# EAGLE schematic bk-circ2-S (EAGLE 9.1.0)
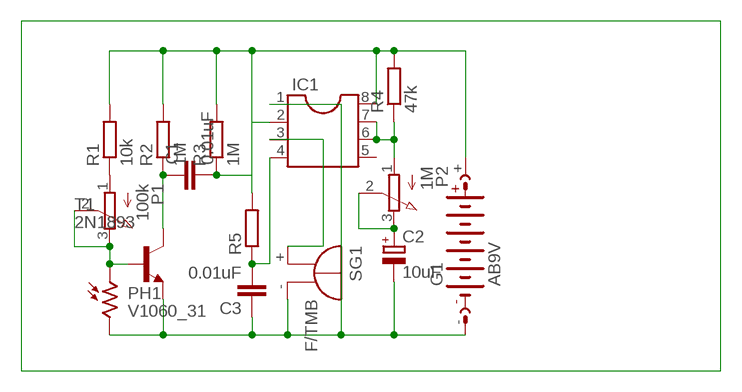
[diagram p0: schematic, sheet 1]

## Parts
C1  0.01uF  C-EU050-025X075  [C050-025X075]
C2  10uF  CPOL-EUB45181B  [B45181B]
C3  0.01uF  C-EU050-025X075  [C050-025X075]
G1  AB9V  [AB9V]
IC1  DIL8  [DIL08]
P1  100k  3RP/1610N  [3RP/1610N]
P2  1M  3RP/1610N  [3RP/1610N]
PH1  V1060_31  [TO-5_V10]
R1  10k  R-EU_0207/7  [0207/7]
R2  1M  R-EU_0207/7  [0207/7]
R3  1M  R-EU_0207/7  [0207/7]
R4  47k  R-EU_0207/7  [0207/7]
R5  R-EU_0207/7  [0207/7]
SG1  F/TMB  [F/TMB]
T1  2N1893  [TO5]

## Nets
N$1: C1.1 R2.1 T1.3(C)
N$2: IC1.6 IC1.7 P2.1(A) R4.1
N$3: P1.1(A) R1.1
N$4: P1.2(S) P1.3(E) PH1.1 T1.2(B)
N$5: G1.+ IC1.8 R1.2 R2.2 R3.2 R4.2 R5.2
N$6: C1.2 IC1.2 R3.1
N$7: C2.+ P2.2(S) P2.3(E)
N$8: C3.2 IC1.4 R5.1
N$9: IC1.3 SG1.+
N$11: C2.- C3.1 G1.- IC1.1 PH1.2 SG1.- T1.1(E)
Unconnected: IC1.5

## Library data of the parts
C1 C3 = resistor:C-EU: CAPACITOR, European symbol
C2 = resistor:CPOL-EU: POLARIZED CAPACITOR, European symbol
G1 = battery:AB9V: 9-V BATTERY CLIP
IC1 = ic-package:DIL8: Dual In Line / Socket
P1 P2 = pot:3RP/1610N: 16mm Potentiometer one level Source: http://www.alphapotentiometers.net/html/16mm_pot_2.html
PH1 = photo-elements:?1060*: Sensor Street Light control Source: http://optoelectronics.perkinelmer.com/content/Datasheets/DTS_PhotocellsB1060.pdf
R1-R5 = resistor:R-EU_: RESISTOR, European symbol
SG1 = buzzer:F/TMB: BUZZER Source: Buerklin; OC_FARNELL: unknown; OC_NEWARK: unknown
T1 = transistor:2N1893: NPN TRANSISTOR